# Altium project 4层智能车.PrjPcb
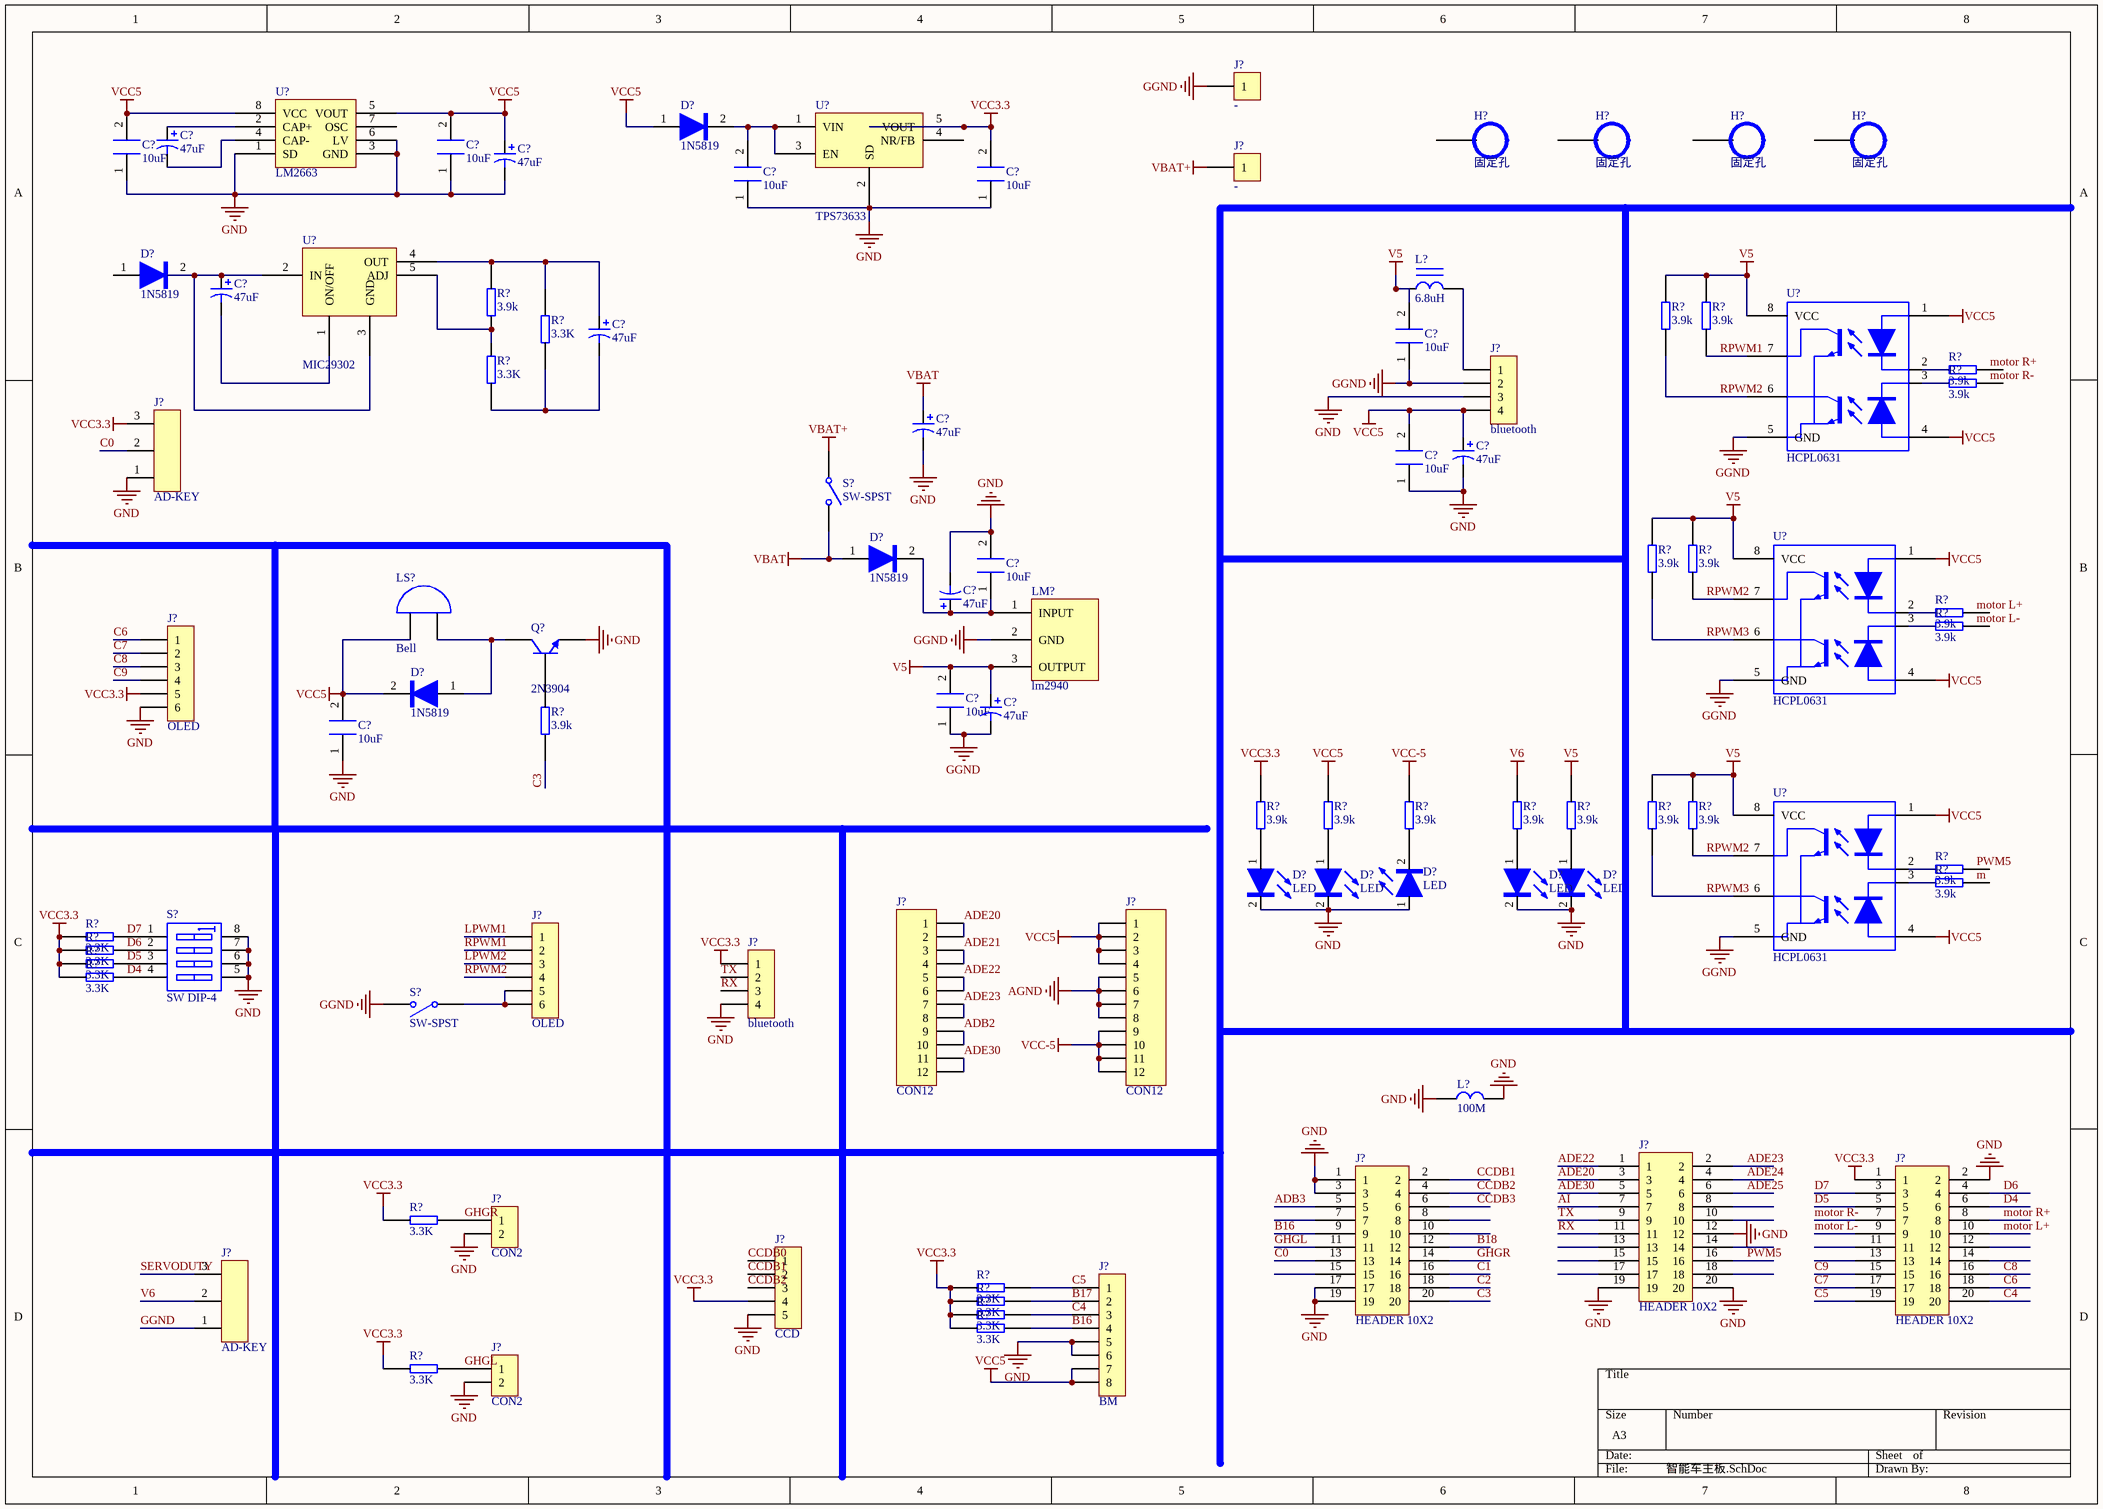
[diagram p0: 智能车主板.SchDoc]
1 sheet, 92 parts. Net scope: global (net labels, ports and power ports of the same name join across sheets).
Board file: 智能车主板PCB.PcbDoc

## Sheet 智能车主板.SchDoc
size A3

### Parts
(Parts that share a designator on the sheet are numbered #1, #2 ... from top to bottom, then left to right.)
C?#1  47uF  [C型钽电容_6032_28]
C?#2  10uF  [0805C]
C?#3  10uF  [0805C]
C?#4  47uF  [C型钽电容_6032_28]
C?#5  10uF  [0805C]
C?#6  10uF  [0805C]
C?#7  47uF  [C型钽电容_6032_28]
C?#8  47uF  [C型钽电容_6032_28]
C?#9  10uF  [0805C]
C?#10  47uF  [C型钽电容_6032_28]
C?#11  47uF  [C型钽电容_6032_28]
C?#12  10uF  [0805C]
C?#13  10uF  [0805C]
C?#14  47uF  [C型钽电容_6032_28]
C?#15  10uF  [0805C]
C?#16  47uF  [C型钽电容_6032_28]
C?#17  10uF  [0805C]
D?#1  1N5819  [0805D]
D?#2  1N5819  [0805D]
D?#3  1N5819  [0805D]
D?#4  1N5819  [0805D]
D?#5  LED  [0805D]
D?#6  LED  [0805D]
D?#7  LED  [0805D]
D?#8  LED  [0805D]
D?#9  LED  [0805D]
H?#1  固定孔  [铜柱孔3]
H?#2  固定孔  [铜柱孔3]
H?#3  固定孔  [铜柱孔3]
H?#4  固定孔  [铜柱孔3]
J?#1  -  [单面焊盘2*3MM_1PIN]
J?#2  -  [单面焊盘2*3MM_1PIN]
J?#3  bluetooth  [HDR1X4]
J?#4  AD-KEY  [HDR1X3]
J?#5  OLED  [HDR1X6]
J?#6  CON12  [HDR2X6]
J?#7  CON12  [HDR2X6]
J?#8  OLED  [HDR1X6]
J?#9  bluetooth  [HDR1X4]
J?#10  CON2  [2PIN杜邦插座_1.27mm]
J?#11  HEADER 10X2  [HDR2X10]
J?#12  HEADER 10X2  [HDR2X10]
J?#13  HEADER 10X2  [HDR2X10]
J?#14  CCD  [HDR1X5]
J?#15  BM  [HDR2X4]
J?#16  AD-KEY  [HDR1X3]
J?#17  CON2  [2PIN杜邦插座_1.27mm]
L?#1  6.8uH  [CDRH3D16_4.2*1.8]
L?#2  100M  [0603L]
LM?  lm2940  [SOT-223]
LS?  Bell  [蜂鸣器侧装]
Q?  2N3904  [TO-92A]
R?#1  3.9k  [0805R]
R?#2  3.9k  [0805R]
R?#3  3.9k  [0805R]
R?#4  3.3K  [0603R]
R?#5  3.3K  [0603R]
R?#6  3.9k  [0805R]
R?#7  3.9k  [0805R]
R?#8  3.9k  [0805R]
R?#9  3.9k  [0805R]
R?#10  3.9k  [0805R]
R?#11  3.9k  [0805R]
R?#12  3.9k  [0805R]
R?#13  3.9k  [0805R]
R?#14  3.9k  [0805R]
R?#15  3.9k  [0805R]
R?#16  3.9k  [0805R]
R?#17  3.9k  [0805R]
R?#18  3.9k  [0805R]
R?#19  3.9k  [0805R]
R?#20  3.9k  [0805R]
R?#21  3.9k  [0805R]
R?#22  3.3K  [0603R]
R?#23  3.3K  [0603R]
R?#24  3.3K  [0603R]
R?#25  3.3K  [0603R]
R?#26  3.3K  [0603R]
R?#27  3.3K  [0603R]
R?#28  3.3K  [0603R]
R?#29  3.3K  [0603R]
R?#30  3.3K  [0603R]
R?#31  3.3K  [0603R]
S?#1  SW-SPST  [开关]
S?#2  SW DIP-4  [4路拨码开关]
S?#3  SW-SPST  [开关]
U?#1  LM2663  [SOP_8(OPA)]
U?#2  TPS73633  [SOT23_5-LEADS]
U?#3  MIC29302  [TO_263_5(10.5*8.4mm)]
U?#4  HCPL0631  [SOP_8(OPA)]
U?#5  HCPL0631  [SOP_8(OPA)]
U?#6  HCPL0631  [SOP_8(OPA)]

### Nets
AGND: J?#7.5 J?#7.6 J?#7.7 J?#7.8
GGND: C?#9.1 C?#15.1 C?#16.2 J?#1.1 J?#3.2 J?#16.1 LM?.2(GND) S?#3.2(NO) U?#4.5(GND) U?#5.5(GND) U?#6.5(GND)
GND: C?#2.1 C?#3.1 C?#4.2 C?#5.1 C?#6.1 C?#10.2 C?#11.2 C?#12.1 C?#13.2 C?#14.2 C?#17.1 D?#5.2 D?#6.2 D?#7.1 D?#8.2 D?#9.2 J?#3.3 J?#4.1 J?#5.6 J?#9.4 J?#10.2 J?#11.12 J?#11.19 J?#11.20 J?#12.1 J?#12.3 J?#12.17 J?#12.19 J?#13.2 J?#14.5 J?#15.5 J?#15.6 J?#17.2 L?#2.1 L?#2.2 Q?.1(E) S?#2.5(B4) S?#2.6(B3) S?#2.7(B2) S?#2.8(B1) U?#1.1(SD) U?#1.3(GND) U?#1.6(LV) U?#2.2(SD)
V5: C?#9.2 C?#15.2 C?#16.1 L?#1.1 LM?.3(OUTPUT) R?#2.1 R?#3.1 R?#8.1 R?#9.1 R?#17.2 R?#18.1 R?#19.1 U?#4.8(VCC) U?#5.8(VCC) U?#6.8(VCC)
V6: J?#16.2 R?#16.2
VBAT: C?#10.1 D?#3.1 S?#1.2(NO)
VBAT+: J?#2.1 S?#1.1(COMMON)
VCC3.3: C?#6.2 J?#4.3 J?#5.5 J?#9.1 J?#13.1 J?#14.4 R?#13.2 R?#22.2 R?#23.2 R?#24.2 R?#25.2 R?#26.2 R?#27.2 R?#28.2 R?#29.2 R?#30.2 R?#31.2 U?#2.5(VOUT)
VCC5: C?#2.2 C?#3.2 C?#4.1 C?#11.1 C?#12.2 C?#17.2 D?#1.1 D?#4.2 J?#3.4 J?#7.1 J?#7.2 J?#7.3 J?#7.4 J?#15.7 J?#15.8 LS?.1(A) R?#14.2 U?#1.5(VOUT) U?#1.8(VCC) U?#4.1 U?#4.4 U?#5.1 U?#5.4 U?#6.1 U?#6.4
VCC-5: J?#7.9 J?#7.10 J?#7.11 J?#7.12 R?#15.2
ADB2: J?#6.9 J?#6.10
ADB3: J?#12.5
ADE20: J?#6.1 J?#6.2 J?#11.3
ADE21: J?#6.3 J?#6.4
ADE22: J?#6.5 J?#6.6 J?#11.1
ADE23: J?#6.7 J?#6.8 J?#11.2
ADE24: J?#11.4
ADE25: J?#11.6
ADE30: J?#6.11 J?#6.12 J?#11.5
AI: J?#11.7
B16: J?#12.9 J?#15.4 R?#30.1
B17: J?#15.2 R?#28.1
B18: J?#12.12
C0: J?#4.2 J?#12.13
C1: J?#12.16
C2: J?#12.18
C3: J?#12.20 R?#12.1
C4: J?#13.20 J?#15.3 R?#29.1
C5: J?#13.19 J?#15.1 R?#27.1
C6: J?#5.1 J?#13.18
C7: J?#5.2 J?#13.17
C8: J?#5.3 J?#13.16
C9: J?#5.4 J?#13.15
CCDB0: J?#14.1
CCDB1: J?#12.2 J?#14.2
CCDB2: J?#12.4 J?#14.3
CCDB3: J?#12.6
D4: J?#13.6
D5: J?#13.5
D6: J?#13.4
D7: J?#13.3
GHGL: J?#12.11 J?#17.1 R?#31.1
GHGR: J?#10.1 J?#12.14 R?#26.1
LPWM1: J?#8.1
LPWM2: J?#8.3
motor L+: J?#13.10
motor L-: J?#13.9
motor R+: J?#13.8
motor R-: J?#13.7
PWM5: J?#11.16
RPWM1: J?#8.2 R?#3.2 U?#4.7
RPWM2: J?#8.4 R?#2.2 R?#9.2 R?#19.2 U?#4.6 U?#5.7 U?#6.7
RPWM3: R?#8.2 R?#18.2 U?#5.6 U?#6.6
RX: J?#9.3 J?#11.11
SERVODUTY: J?#16.3
TX: J?#9.2 J?#11.9
NetC?#1_1: C?#1.1 U?#1.2(CAP+)
NetC?#1_2: C?#1.2 U?#1.4(CAP-)
NetC?#5_2: C?#5.2 D?#1.2 U?#2.1(VIN) U?#2.3(EN)
NetC?#7_1: C?#7.1 D?#2.2 U?#3.2(IN) U?#3.3(GND)
NetC?#7_2: C?#7.2 U?#3.1(ON/OFF)
NetC?#8_1: C?#8.1 R?#1.2 R?#4.1 U?#3.4(OUT)
NetC?#8_2: C?#8.2 R?#4.2 R?#5.2
NetC?#13_1: C?#13.1 C?#14.1 D?#3.2 LM?.1(INPUT)
NetD?#4_1: D?#4.1 LS?.2(B) Q?.3(C)
NetD?#5_1: D?#5.1 R?#13.1
NetD?#6_1: D?#6.1 R?#14.1
NetD?#7_2: D?#7.2 R?#15.1
NetD?#8_1: D?#8.1 R?#16.1
NetD?#9_1: D?#9.1 R?#17.1
NetJ?#3_1: J?#3.1 L?#1.2
NetJ?#8_5: J?#8.5 J?#8.6 S?#3.1(COMMON)
NetQ?_2: Q?.2(B) R?#12.2
NetR?#1_1: R?#1.1 R?#5.1 U?#3.5(ADJ)
NetR?#6_2: R?#6.2 U?#4.2
NetR?#7_2: R?#7.2 U?#4.3
NetR?#10_2: R?#10.2 U?#5.2
NetR?#11_2: R?#11.2 U?#5.3
NetR?#20_2: R?#20.2 U?#6.2
NetR?#21_2: R?#21.2 U?#6.3
NetR?#22_1: R?#22.1 S?#2.1(A1)
NetR?#23_1: R?#23.1 S?#2.2(A2)
NetR?#24_1: R?#24.1 S?#2.3(A3)
NetR?#25_1: R?#25.1 S?#2.4(A4)

Not connected (* = marked no-connect by the designer): D?#2 1; H?#1 11; H?#2 11; H?#3 11; H?#4 11; J?#11 8 10 13 14 15 17 18; J?#12 7 8 10 15; J?#13 11 12 13 14; R?#6 1; R?#7 1; R?#10 1; R?#11 1; R?#20 1; R?#21 1; U?#1 7(OSC); U?#2 4(NR/FB)

### Notes on the sheet
- Labels drawn without touching a wire or pin: D4, D5, D6, D7, m, motor L+, motor L-, motor R+, motor R-, PWM5

### Library data of the parts
C?#1 C?#4 C?#7 C?#8 C?#10 C?#11 C?#14 C?#16 = 极性电容
C?#2 C?#3 C?#5 C?#6 C?#9 C?#12 C?#13 C?#15 C?#17 = CAP_1: 电容
D?#1-D?#4 = SS34: 二极管
J?#1 J?#2 = CON1: Connector
J?#3 J?#9 = CON4: Connector
J?#4 J?#16 = CON3: SOCKET
J?#5 J?#8 = CON6: Connector
J?#6 J?#7 = CON12: Connector
J?#10 J?#17 = CON2: Connector
J?#11-J?#13 = HEADER 10X2: 排针
J?#14 = CON5: Connector
J?#15 = CON8: Connector
L?#1 = INDUCTOR: 电感
L?#2 = INDUCTOR_2
LM? = lm2940: IC
LS? = Bell: Electrical Bell; Published: 24-Mar-1999; LatestRevisionDate: 17-Jul-2002; LatestRevisionNote: Re-released for DXP Platform.; PackageReference: PIN2; Publisher: Altium Limited
Q? = 2N3904: NPN General Purpose Amplifier; Published: 8-Jun-2000; LatestRevisionDate: 15-Jan-2003; LatestRevisionNote: PCB Footprint 'BCY-W3/D4.7' replaced; DatasheetDocument: 1997; PackageDocument: Sep-1998; PackageReference: TO-92A; Publisher: Altium Limited; Code_JEDEC: TO-92A; ComponentLink1Description: Manufacturer Link; ComponentLink1URL: http://www.fairchildsemi.com/; ComponentLink2Description: Datasheet; ComponentLink2URL: http://www.fairchildsemi.com/ds/2N%2F2N3904.pdf
R?#1-R?#3 R?#6-R?#21 = RES_1: 电阻
R?#4 R?#5 R?#22-R?#31 = RES_1_1: 电阻
S?#1 S?#3 = SW-SPST: Single-Pole, Single-Throw Switch; Published: 24-Mar-1999; LatestRevisionDate: 17-Jul-2002; LatestRevisionNote: Re-released for DXP Platform.; PackageReference: SPST-2; Publisher: Altium Limited; PackageDescription: Switch; 2 Leads
S?#2 = SW DIP-4: DIP Switch
U?#1 = LM2663: IC
U?#2 = TPS73633: IC
U?#3 = MIC29302: IC
U?#4-U?#6 = HCPL0631: 光耦